# Altium project GD.PrjPCB
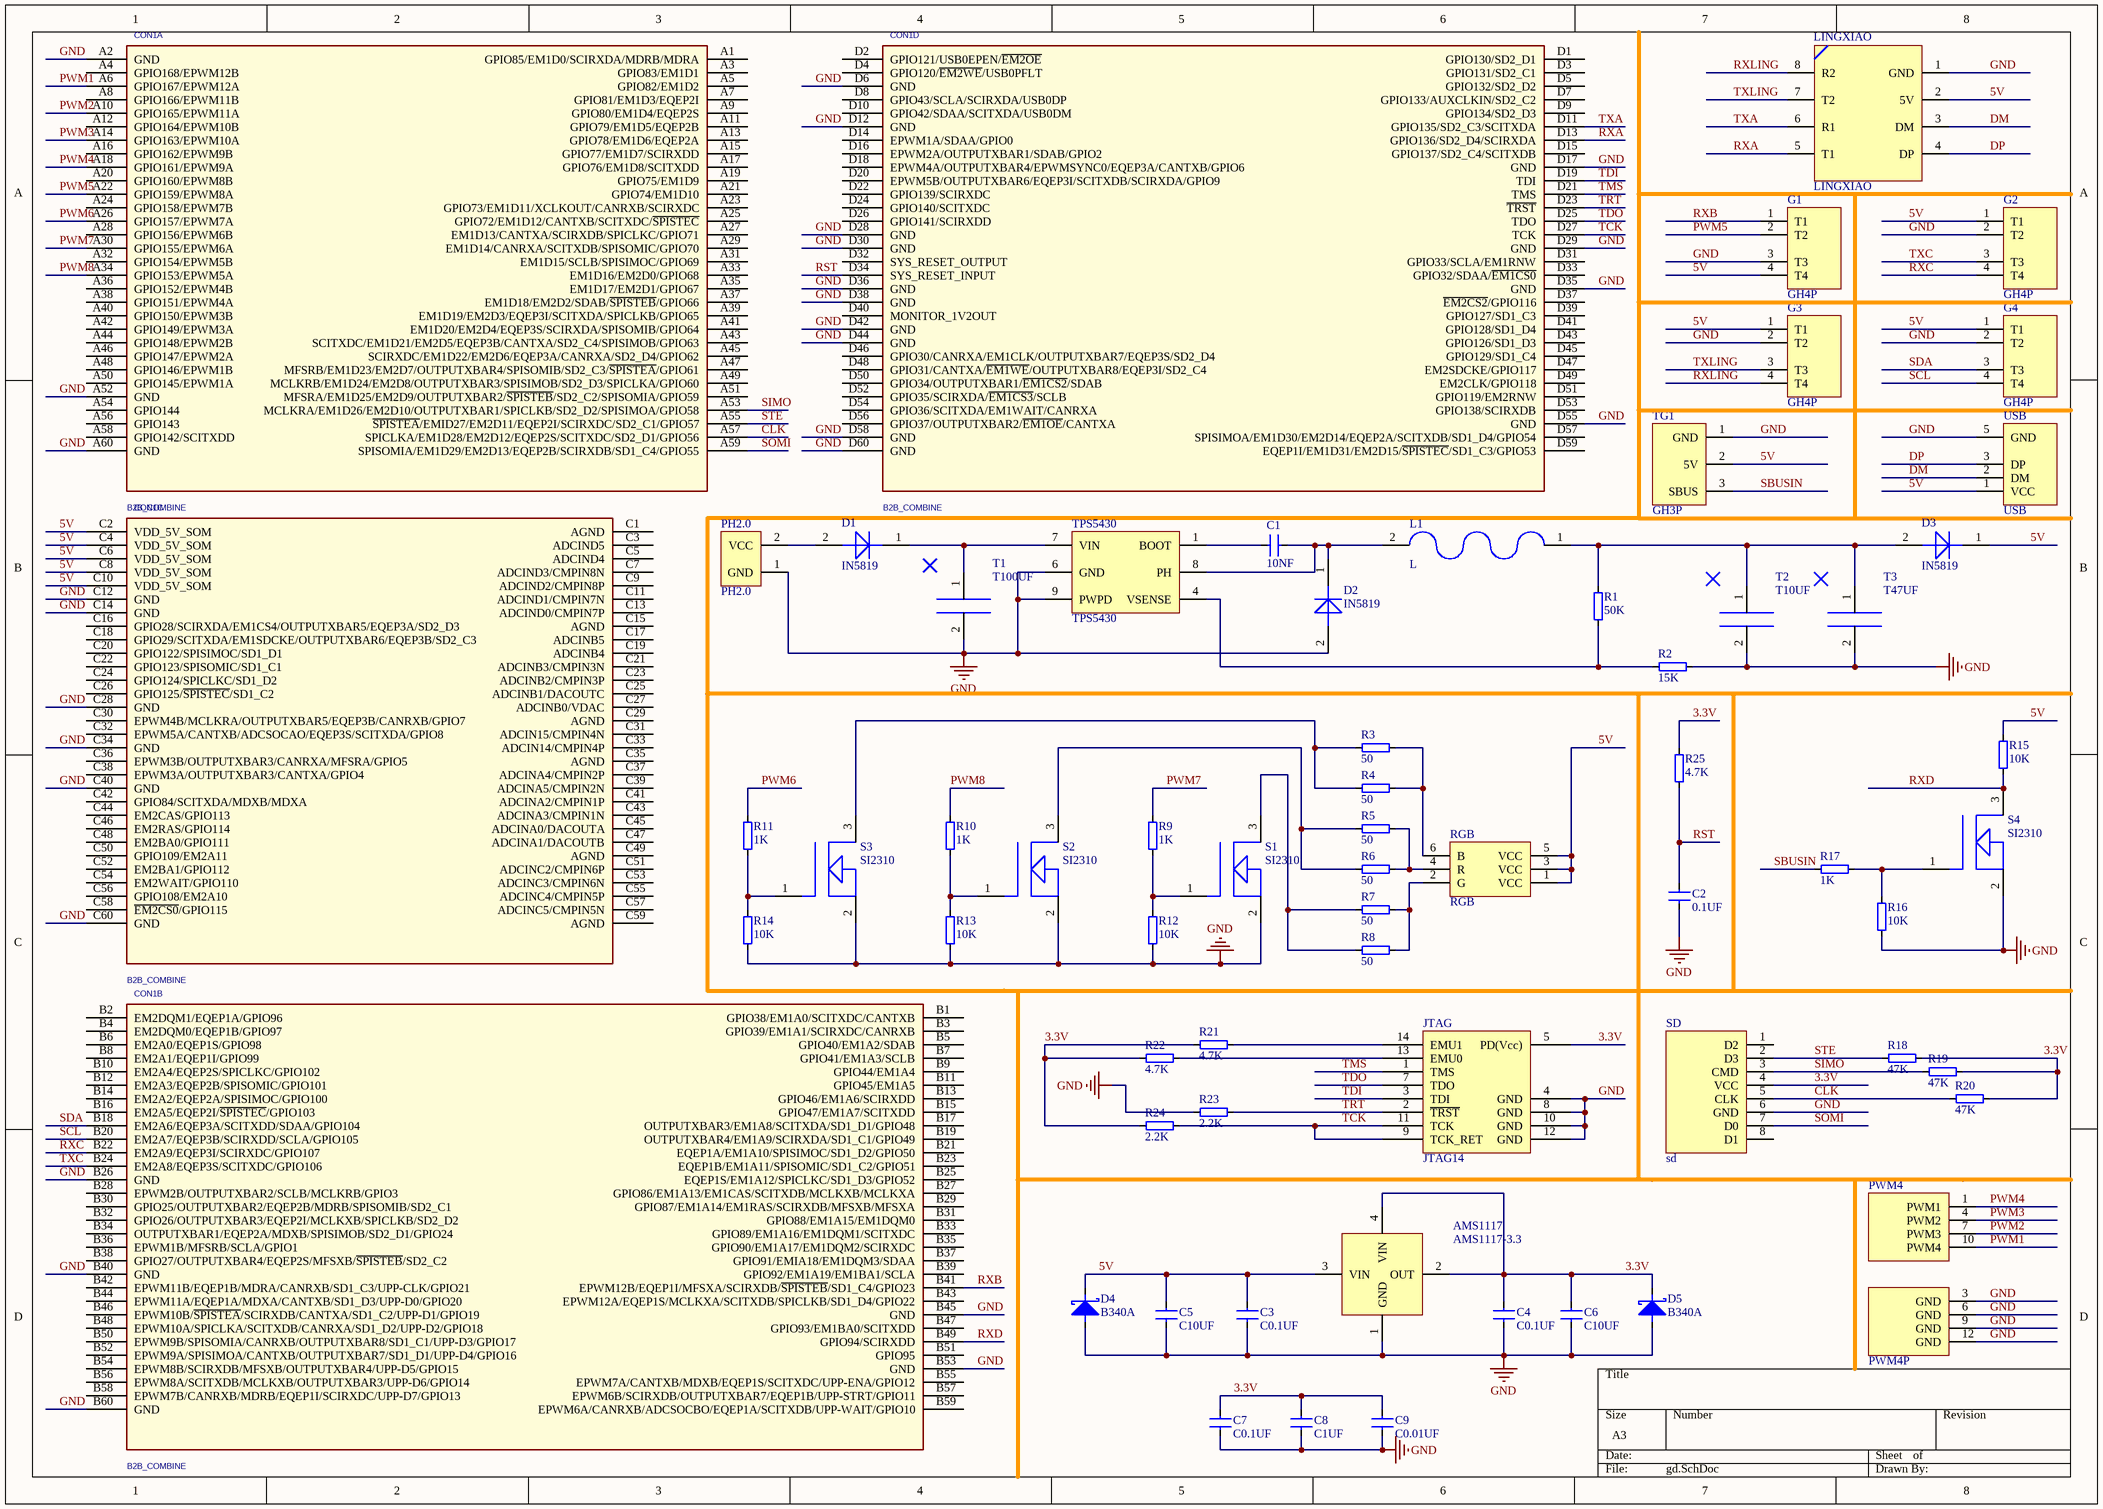
[diagram p0: gd.SchDoc]
1 sheet, 62 parts. Net scope: global (net labels, ports and power ports of the same name join across sheets).
Board file: gd.PcbDoc

## Sheet gd.SchDoc
size A3

### Parts
AMS1117  AMS1117-3.3  [SOT-223]
C1  10NF  [C0603]
C2  0.1UF  [C0603]
C3  C0.1UF  [X0603]
C4  C0.1UF  [X0603]
C5  C10UF  [X0603]
C6  C10UF  [X0603]
C7  C0.1UF  [X0603]
C8  C1UF  [X0603]
C9  C0.01UF  [X0603]
CON1  B2B_COMBINE  [B2B_0D50_60P_28377]  (parts A,B,C,D of 4)
D1  IN5819  [IN5819]
D2  IN5819  [IN5819]
D3  IN5819  [IN5819]
D4  B340A  [B340A]
D5  B340A  [B340A]
G1  GH4P  [GH4P]
G2  GH4P  [GH4P]
G3  GH4P  [GH4P]
G4  GH4P  [GH4P]
JTAG  JTAG14  [CON2X7PA_2-54MM-N6]
L1  L  [L]
LINGXIAO  LINGXIAO  [LINGXIAO]
PH2.0  PH2.0  [PH2.0]
PWM4  PWM4P  [PWM4P]
R1  50K  [X0603]
R2  15K  [X0603]
R3  50  [X0603]
R4  50  [X0603]
R5  50  [X0603]
R6  50  [X0603]
R7  50  [X0603]
R8  50  [X0603]
R9  1K  [X0603]
R10  1K  [X0603]
R11  1K  [X0603]
R12  10K  [X0603]
R13  10K  [X0603]
R14  10K  [X0603]
R15  10K  [X0603]
R16  10K  [X0603]
R17  1K  [X0603]
R18  47K  [X0603]
R19  47K  [X0603]
R20  47K  [X0603]
R21  4.7K  [X0603]
R22  4.7K  [X0603]
R23  2.2K  [X0603]
R24  2.2K  [X0603]
R25  4.7K  [X0603]
RGB  RGB  [RGB]
S1  SI2310  [SI2310]
S2  SI2310  [SI2310]
S3  SI2310  [SI2310]
S4  SI2310  [SI2310]
SD  sd  [sd]
T1  T100UF  [T100UF]
T2  T10UF  [T10UF]
T3  T47UF  [T47UF]
TG1  GH3P  [GH3P]
TPS5430  TPS5430  [TPS5430]
USB  USB  [USB]

### Nets
GND: AMS1117.1(GND) C2.1 C3.1 C4.1 C5.1 C6.1 C7.1 C8.1 C9.1 CON1.A2(GND) CON1.A52(GND) CON1.A60(GND) CON1.B26(GND) CON1.B40(GND) CON1.B45(GND) CON1.B53(GND) CON1.B60(GND) CON1.C12(GND) CON1.C14(GND) CON1.C28(GND) CON1.C34(GND) CON1.C40(GND) CON1.C60(GND) CON1.D6(GND) CON1.D12(GND) CON1.D17(GND) CON1.D28(GND) CON1.D29(GND) CON1.D30(GND) CON1.D35(GND) CON1.D36(GND) CON1.D38(GND) CON1.D42(GND) CON1.D44(GND) CON1.D55(GND) CON1.D58(GND) CON1.D60(GND) D2.2(T2) D4.A D5.A G1.3(T3) G2.2(T2) G3.2(T2) G4.2(T2) JTAG.4(GND) JTAG.8(GND) JTAG.10(GND) JTAG.12(GND) LINGXIAO.1(GND) PH2.0.1(GND) PWM4.3(GND) PWM4.6(GND) PWM4.9(GND) PWM4.12(GND) R2.2 R12.1 R13.1 R14.1 R16.2 R23.1 S1.2(B) S2.2(B) S3.2(B) S4.2(B) SD.6(GND) T1.2(B) T2.2(B) T3.2(B) TG1.1(GND) TPS5430.6(GND) TPS5430.9(PWPD) USB.5(GND)
3.3V: AMS1117.2(OUT) AMS1117.4(VIN) C4.2 C6.2 C7.2 C8.2 C9.2 D5.K JTAG.5(PD(Vcc)) R18.2 R19.2 R20.2 R21.1 R22.1 R24.1 R25.2 SD.4(VCC)
5V: AMS1117.3(VIN) C3.2 C5.2 CON1.C2(VDD_5V_SOM) CON1.C4(VDD_5V_SOM) CON1.C6(VDD_5V_SOM) CON1.C8(VDD_5V_SOM) CON1.C10(VDD_5V_SOM) D3.1(T1) D4.K G1.4(T4) G2.1(T1) G3.1(T1) G4.1(T1) LINGXIAO.2(5V) R15.2 RGB.1(VCC) RGB.3(VCC) RGB.5(VCC) TG1.2(5V) USB.1(VCC)
CLK: CON1.A57(SPICLKA/EM1D28/EM2D12/EQEP2S/SCITXDC/SD2_D1/GPIO56) R20.1 SD.5(CLK)
DM: LINGXIAO.3(DM) USB.2(DM)
DP: LINGXIAO.4(DP) USB.3(DP)
PWM1: CON1.A6(GPIO167/EPWM12A) PWM4.10(PWM4)
PWM2: CON1.A10(GPIO165/EPWM11A) PWM4.7(PWM3)
PWM3: CON1.A14(GPIO163/EPWM10A) PWM4.4(PWM2)
PWM4: CON1.A18(GPIO161/EPWM9A) PWM4.1(PWM1)
PWM5: CON1.A22(GPIO159/EPWM8A) G1.2(T2)
PWM6: CON1.A26(GPIO157/EPWM7A) R11.2
PWM7: CON1.A30(GPIO155/EPWM6A) R9.2
PWM8: CON1.A34(GPIO153/EPWM5A) R10.2
RST: C2.2 CON1.D34(SYS_RESET_INPUT) R25.1
RXA: CON1.D13(GPIO136/SD2_D4/SCIRXDA) LINGXIAO.5(T1)
RXB: CON1.B41(EPWM12B/EQEP1I/MFSXA/SCIRXDB/~{SPISTEB}/SD1_C4/GPIO23) G1.1(T1)
RXC: CON1.B22(EM2A9/EQEP3I/SCIRXDC/GPIO107) G2.4(T4)
RXD: CON1.B49(GPIO94/SCIRXDD) R15.1 S4.3(B)
RXLING: G3.4(T4) LINGXIAO.8(R2)
SBUSIN: R17.1 TG1.3(SBUS)
SCL: CON1.B20(EM2A7/EQEP3B/SCIRXDD/SCLA/GPIO105) G4.4(T4)
SDA: CON1.B18(EM2A6/EQEP3A/SCITXDD/SDAA/GPIO104) G4.3(T3)
SIMO: CON1.A53(MCLKRA/EM1D26/EM2D10/OUTPUTXBAR1/SPICLKB/SD2_D2/SPISIMOA/GPIO58) R19.1 SD.3(CMD)
SOMI: CON1.A59(SPISOMIA/EM1D29/EM2D13/EQEP2B/SCIRXDB/SD1_C4/GPIO55) SD.7(D0)
STE: CON1.A55(~{SPISTEA}/EMID27/EM2D11/EQEP2I/SCIRXDC/SD2_C1/GPIO57) R18.1 SD.2(D3)
TCK: CON1.D27(TCK) JTAG.9(TCK_RET) JTAG.11(TCK) R24.2
TDI: CON1.D19(TDI) JTAG.3(TDI)
TDO: CON1.D25(TDO) JTAG.7(TDO)
TMS: CON1.D21(TMS) JTAG.1(TMS)
TRT: CON1.D23(~{TRST}) JTAG.2(~{TRST}) R23.2
TXA: CON1.D11(GPIO135/SD2_C3/SCITXDA) LINGXIAO.6(R1)
TXC: CON1.B24(EM2A8/EQEP3S/SCITXDC/GPIO106) G2.3(T3)
TXLING: G3.3(T3) LINGXIAO.7(T2)
NetC1_1: C1.1 TPS5430.1(BOOT)
NetC1_2: C1.2 D2.1(T1) L1.2(T4) TPS5430.8(PH)
NetD1_1: D1.1(T1) T1.1(B) TPS5430.7(VIN)
NetD1_2: D1.2(T2) PH2.0.2(VCC)
NetD3_2: D3.2(T2) L1.1(T3) R1.2 T2.1(B) T3.1(B)
NetJTAG_13: JTAG.13(EMU0) R22.2
NetJTAG_14: JTAG.14(EMU1) R21.2
NetR1_1: R1.1 R2.1 TPS5430.4(VSENSE)
NetR3_1: R3.1 R4.1 S3.3(B)
NetR3_2: R3.2 R4.2 RGB.6(B)
NetR5_1: R5.1 R6.1 S2.3(B)
NetR5_2: R5.2 R6.2 RGB.4(R)
NetR7_1: R7.1 R8.1 S1.3(B)
NetR7_2: R7.2 R8.2 RGB.2(G)
NetR9_1: R9.1 R12.2 S1.1(B)
NetR10_1: R10.1 R13.2 S2.1(B)
NetR11_1: R11.1 R14.2 S3.1(B)
NetR16_1: R16.1 R17.2 S4.1(B)

Not connected (* = marked no-connect by the designer): CON1 A1(GPIO85/EM1D0/SCIRXDA/MDRB/MDRA) A3(GPIO83/EM1D1) A4(GPIO168/EPWM12B) A5(GPIO82/EM1D2) A7(GPIO81/EM1D3/EQEP2I) A8(GPIO166/EPWM11B) A9(GPIO80/EM1D4/EQEP2S) A11(GPIO79/EM1D5/EQEP2B) A12(GPIO164/EPWM10B) A13(GPIO78/EM1D6/EQEP2A) A15(GPIO77/EM1D7/SCIRXDD) A16(GPIO162/EPWM9B) A17(GPIO76/EM1D8/SCITXDD) A19(GPIO75/EM1D9) A20(GPIO160/EPWM8B) A21(GPIO74/EM1D10) A23(GPIO73/EM1D11/XCLKOUT/CANRXB/SCIRXDC) A24(GPIO158/EPWM7B) A25(GPIO72/EM1D12/CANTXB/SCITXDC/~{SPISTEC}) A27(EM1D13/CANTXA/SCIRXDB/SPICLKC/GPIO71) A28(GPIO156/EPWM6B) A29(EM1D14/CANRXA/SCITXDB/SPISOMIC/GPIO70) A31(EM1D15/SCLB/SPISIMOC/GPIO69) A32(GPIO154/EPWM5B) A33(EM1D16/EM2D0/GPIO68) A35(EM1D17/EM2D1/GPIO67) A36(GPIO152/EPWM4B) A37(EM1D18/EM2D2/SDAB/~{SPISTEB}/GPIO66) A38(GPIO151/EPWM4A) A39(EM1D19/EM2D3/EQEP3I/SCITXDA/SPICLKB/GPIO65) A40(GPIO150/EPWM3B) A41(EM1D20/EM2D4/EQEP3S/SCIRXDA/SPISOMIB/GPIO64) A42(GPIO149/EPWM3A) A43(SCITXDC/EM1D21/EM2D5/EQEP3B/CANTXA/SD2_C4/SPISIMOB/GPIO63) A44(GPIO148/EPWM2B) A45(SCIRXDC/EM1D22/EM2D6/EQEP3A/CANRXA/SD2_D4/GPIO62) A46(GPIO147/EPWM2A) A47(MFSRB/EM1D23/EM2D7/OUTPUTXBAR4/SPISOMIB/SD2_C3/~{SPISTEA}/GPIO61) A48(GPIO146/EPWM1B) A49(MCLKRB/EM1D24/EM2D8/OUTPUTXBAR3/SPISIMOB/SD2_D3/SPICLKA/GPIO60) A50(GPIO145/EPWM1A) A51(MFSRA/EM1D25/EM2D9/OUTPUTXBAR2/~{SPISTEB}/SD2_C2/SPISOMIA/GPIO59) A54(GPIO144) A56(GPIO143) A58(GPIO142/SCITXDD) B1(GPIO38/EM1A0/SCITXDC/CANTXB) B2(EM2DQM1/EQEP1A/GPIO96) B3(GPIO39/EM1A1/SCIRXDC/CANRXB) B4(EM2DQM0/EQEP1B/GPIO97) B5(GPIO40/EM1A2/SDAB) B6(EM2A0/EQEP1S/GPIO98) B7(GPIO41/EM1A3/SCLB) B8(EM2A1/EQEP1I/GPIO99) B9(GPIO44/EM1A4) B10(EM2A4/EQEP2S/SPICLKC/GPIO102) B11(GPIO45/EM1A5) B12(EM2A3/EQEP2B/SPISOMIC/GPIO101) B13(GPIO46/EM1A6/SCIRXDD) B14(EM2A2/EQEP2A/SPISIMOC/GPIO100) B15(GPIO47/EM1A7/SCITXDD) B16(EM2A5/EQEP2I/~{SPISTEC}/GPIO103) B17(OUTPUTXBAR3/EM1A8/SCITXDA/SD1_D1/GPIO48) B19(OUTPUTXBAR4/EM1A9/SCIRXDA/SD1_C1/GPIO49) B21(EQEP1A/EM1A10/SPISIMOC/SD1_D2/GPIO50) B23(EQEP1B/EM1A11/SPISOMIC/SD1_C2/GPIO51) B25(EQEP1S/EM1A12/SPICLKC/SD1_D3/GPIO52) B27(GPIO86/EM1A13/EM1CAS/SCITXDB/MCLKXB/MCLKXA) B28(EPWM2B/OUTPUTXBAR2/SCLB/MCLKRB/GPIO3) B29(GPIO87/EM1A14/EM1RAS/SCIRXDB/MFSXB/MFSXA) B30(GPIO25/OUTPUTXBAR2/EQEP2B/MDRB/SPISOMIB/SD2_C1) B31(GPIO88/EM1A15/EM1DQM0) B32(GPIO26/OUTPUTXBAR3/EQEP2I/MCLKXB/SPICLKB/SD2_D2) B33(GPIO89/EM1A16/EM1DQM1/SCITXDC) B34(OUTPUTXBAR1/EQEP2A/MDXB/SPISIMOB/SD2_D1/GPIO24) B35(GPIO90/EM1A17/EM1DQM2/SCIRXDC) B36(EPWM1B/MFSRB/SCLA/GPIO1) B37(GPIO91/EMIA18/EM1DQM3/SDAA) B38(GPIO27/OUTPUTXBAR4/EQEP2S/MFSXB/~{SPISTEB}/SD2_C2) B39(GPIO92/EM1A19/EM1BA1/SCLA) B42(EPWM11B/EQEP1B/MDRA/CANRXB/SD1_C3/UPP-CLK/GPIO21) B43(EPWM12A/EQEP1S/MCLKXA/SCITXDB/SPICLKB/SD1_D4/GPIO22) B44(EPWM11A/EQEP1A/MDXA/CANTXB/SD1_D3/UPP-D0/GPIO20) B46(EPWM10B/~{SPISTEA}/SCIRXDB/CANTXA/SD1_C2/UPP-D1/GPIO19) B47(GPIO93/EM1BA0/SCITXDD) B48(EPWM10A/SPICLKA/SCITXDB/CANRXA/SD1_D2/UPP-D2/GPIO18) B50(EPWM9B/SPISOMIA/CANRXB/OUTPUTXBAR8/SD1_C1/UPP-D3/GPIO17) B51(GPIO95) B52(EPWM9A/SPISIMOA/CANTXB/OUTPUTXBAR7/SD1_D1/UPP-D4/GPIO16) B54(EPWM8B/SCIRXDB/MFSXB/OUTPUTXBAR4/UPP-D5/GPIO15) B55(EPWM7A/CANTXB/MDXB/EQEP1S/SCITXDC/UPP-ENA/GPIO12) B56(EPWM8A/SCITXDB/MCLKXB/OUTPUTXBAR3/UPP-D6/GPIO14) B57(EPWM6B/SCIRXDB/OUTPUTXBAR7/EQEP1B/UPP-STRT/GPIO11) B58(EPWM7B/CANRXB/MDRB/EQEP1I/SCIRXDC/UPP-D7/GPIO13) B59(EPWM6A/CANRXB/ADCSOCBO/EQEP1A/SCITXDB/UPP-WAIT/GPIO10) C1(AGND) C3(ADCIND5) C5(ADCIND4) C7(ADCIND3/CMPIN8N) C9(ADCIND2/CMPIN8P) C11(ADCIND1/CMPIN7N) C13(ADCIND0/CMPIN7P) C15(AGND) C16(GPIO28/SCIRXDA/EM1CS4/OUTPUTXBAR5/EQEP3A/SD2_D3) C17(ADCINB5) C18(GPIO29/SCITXDA/EM1SDCKE/OUTPUTXBAR6/EQEP3B/SD2_C3) C19(ADCINB4) C20(GPIO122/SPISIMOC/SD1_D1) C21(ADCINB3/CMPIN3N) C22(GPIO123/SPISOMIC/SD1_C1) C23(ADCINB2/CMPIN3P) C24(GPIO124/SPICLKC/SD1_D2) C25(ADCINB1/DACOUTC) C26(GPIO125/~{SPISTEC}/SD1_C2) C27(ADCINB0/VDAC) C29(AGND) C30(EPWM4B/MCLKRA/OUTPUTXBAR5/EQEP3B/CANRXB/GPIO7) C31(ADCIN15/CMPIN4N) C32(EPWM5A/CANTXB/ADCSOCAO/EQEP3S/SCITXDA/GPIO8) C33(ADCIN14/CMPIN4P) C35(AGND) C36(EPWM3B/OUTPUTXBAR3/CANRXA/MFSRA/GPIO5) C37(ADCINA4/CMPIN2P) C38(EPWM3A/OUTPUTXBAR3/CANTXA/GPIO4) C39(ADCINA5/CMPIN2N) C41(ADCINA2/CMPIN1P) C42(GPIO84/SCITXDA/MDXB/MDXA) C43(ADCINA3/CMPIN1N) C44(EM2CAS/GPIO113) C45(ADCINA0/DACOUTA) C46(EM2RAS/GPIO114) C47(ADCINA1/DACOUTB) C48(EM2BA0/GPIO111) C49(AGND) C50(GPIO109/EM2A11) C51(ADCINC2/CMPIN6P) C52(EM2BA1/GPIO112) C53(ADCINC3/CMPIN6N) C54(EM2WAIT/GPIO110) C55(ADCINC4/CMPIN5P) C56(GPIO108/EM2A10) C57(ADCINC5/CMPIN5N) C58(~{EM2CS0}/GPIO115) C59(AGND) D1(GPIO130/SD2_D1) D2(GPIO121/USB0EPEN/~{EM2OE}) D3(GPIO131/SD2_C1) D4(GPIO120/~{EM2WE}/USB0PFLT) D5(GPIO132/SD2_D2) D7(GPIO133/AUXCLKIN/SD2_C2) D8(GPIO43/SCLA/SCIRXDA/USB0DP) D9(GPIO134/SD2_D3) D10(GPIO42/SDAA/SCITXDA/USB0DM) D14(EPWM1A/SDAA/GPIO0) D15(GPIO137/SD2_C4/SCITXDB) D16(EPWM2A/OUTPUTXBAR1/SDAB/GPIO2) D18(EPWM4A/OUTPUTXBAR4/EPWMSYNC0/EQEP3A/CANTXB/GPIO6) D20(EPWM5B/OUTPUTXBAR6/EQEP3I/SCITXDB/SCIRXDA/GPIO9) D22(GPIO139/SCIRXDC) D24(GPIO140/SCITXDC) D26(GPIO141/SCIRXDD) D31(GPIO33/SCLA/EM1RNW) D32(SYS_RESET_OUTPUT) D33(GPIO32/SDAA/~{EM1CS0}) D37(~{EM2CS2}/GPIO116) D39(GPIO127/SD1_C3) D40(MONITOR_1V2OUT) D41(GPIO128/SD1_D4) D43(GPIO126/SD1_D3) D45(GPIO129/SD1_C4) D46(GPIO30/CANRXA/EM1CLK/OUTPUTXBAR7/EQEP3S/SD2_D4) D47(EM2SDCKE/GPIO117) D48(GPIO31/CANTXA/~{EM1WE}/OUTPUTXBAR8/EQEP3I/SD2_C4) D49(EM2CLK/GPIO118) D50(GPIO34/OUTPUTXBAR1/~{EM1CS2}/SDAB) D51(GPIO119/EM2RNW) D52(GPIO35/SCIRXDA/~{EM1CS3}/SCLB) D53(GPIO138/SCIRXDB) D54(GPIO36/SCITXDA/EM1WAIT/CANRXA) D56(GPIO37/OUTPUTXBAR2/~{EM1OE}/CANTXA) D57(SPISIMOA/EM1D30/EM2D14/EQEP2A/SCITXDB/SD1_D4/GPIO54) D59(EQEP1I/EM1D31/EM2D15/~{SPISTEC}/SD1_C3/GPIO53); SD 1(D2) 8(D1)

### Library data of the parts
C1 C2 = CAP
C8 C9 = C0.1UF
CON1 = B2B_COMBINE_2: Manufacturer: 连科; SPLIT_INST: TRUE; SWAP_INFO: (S1+S2+S3+S4); Graphic: B2B_COMBINEA.Normal; Power Pins Visible: False; Source Library: E:\TRONLONG\PRODUCT\TMS320F28377R\HARDWARE\A2\SOM\SCH\LIBRARY2.OLB; Location Y-Coordinate: 0; Implementation Type: <none>; Primitive: DEFAULT; Name: I16800166; Source Package: B2B_COMBINE; Source Part: B2B_COMBINEA.Normal; Color: Default; Location X-Coordinate: 0
JTAG = JTAG-1
R1-R25 = R1K